# EAGLE design NRF - Nano (EAGLE 6.5.0)
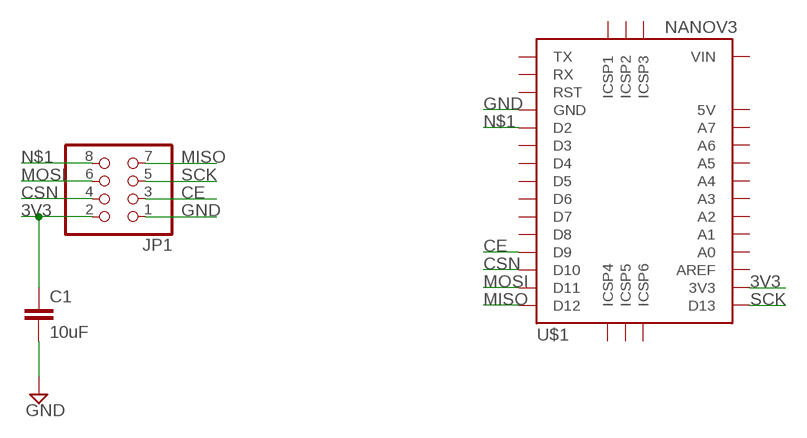
[diagram p0: schematic, sheet 1]

## Parts
C1  10uF  CAPPTH2  [CAP-PTH-SMALL2]
JP1  PINHD-2X4  [2X04]
U$1  NANOV3  [NANOV3]

## Nets
3V3: C1.1 JP1.2 U$1.3V3
CE: JP1.3 U$1.D9
CSN: JP1.4 U$1.D10
GND: C1.2 JP1.1 U$1.GND1(GND) U$1.GND2(GND)
MISO: JP1.7 U$1.D12
MOSI: JP1.6 U$1.D11
N$1: JP1.8 U$1.D2
SCK: JP1.5 U$1.D13
Unconnected: U$1.5V U$1.A0 U$1.A1 U$1.A2 U$1.A3 U$1.A4 U$1.A5 U$1.A6 U$1.A7 U$1.AREF U$1.D3 U$1.D4 U$1.D5 U$1.D6 U$1.D7 U$1.D8 U$1.P$31(ICSP4) U$1.P$32(ICSP5) U$1.P$33(ICSP6) U$1.P$34(ICSP1) U$1.P$35(ICSP2) U$1.P$36(ICSP3) U$1.RST1(RST) U$1.RST2(RST) U$1.RX U$1.TX

## Power pins joined to a net without a drawn wire
VIN: U$1.VIN

## Library data of the parts
C1 = SparkFun-Capacitors:CAP: Capacitor Standard 0603 ceramic capacitor, and 0.1" leaded capacitor.
JP1 = pinhead:PINHD-2X4: PIN HEADER
U$1 = Franc:NANOV3: Arduino Nano Version 3 (v3)

## Board
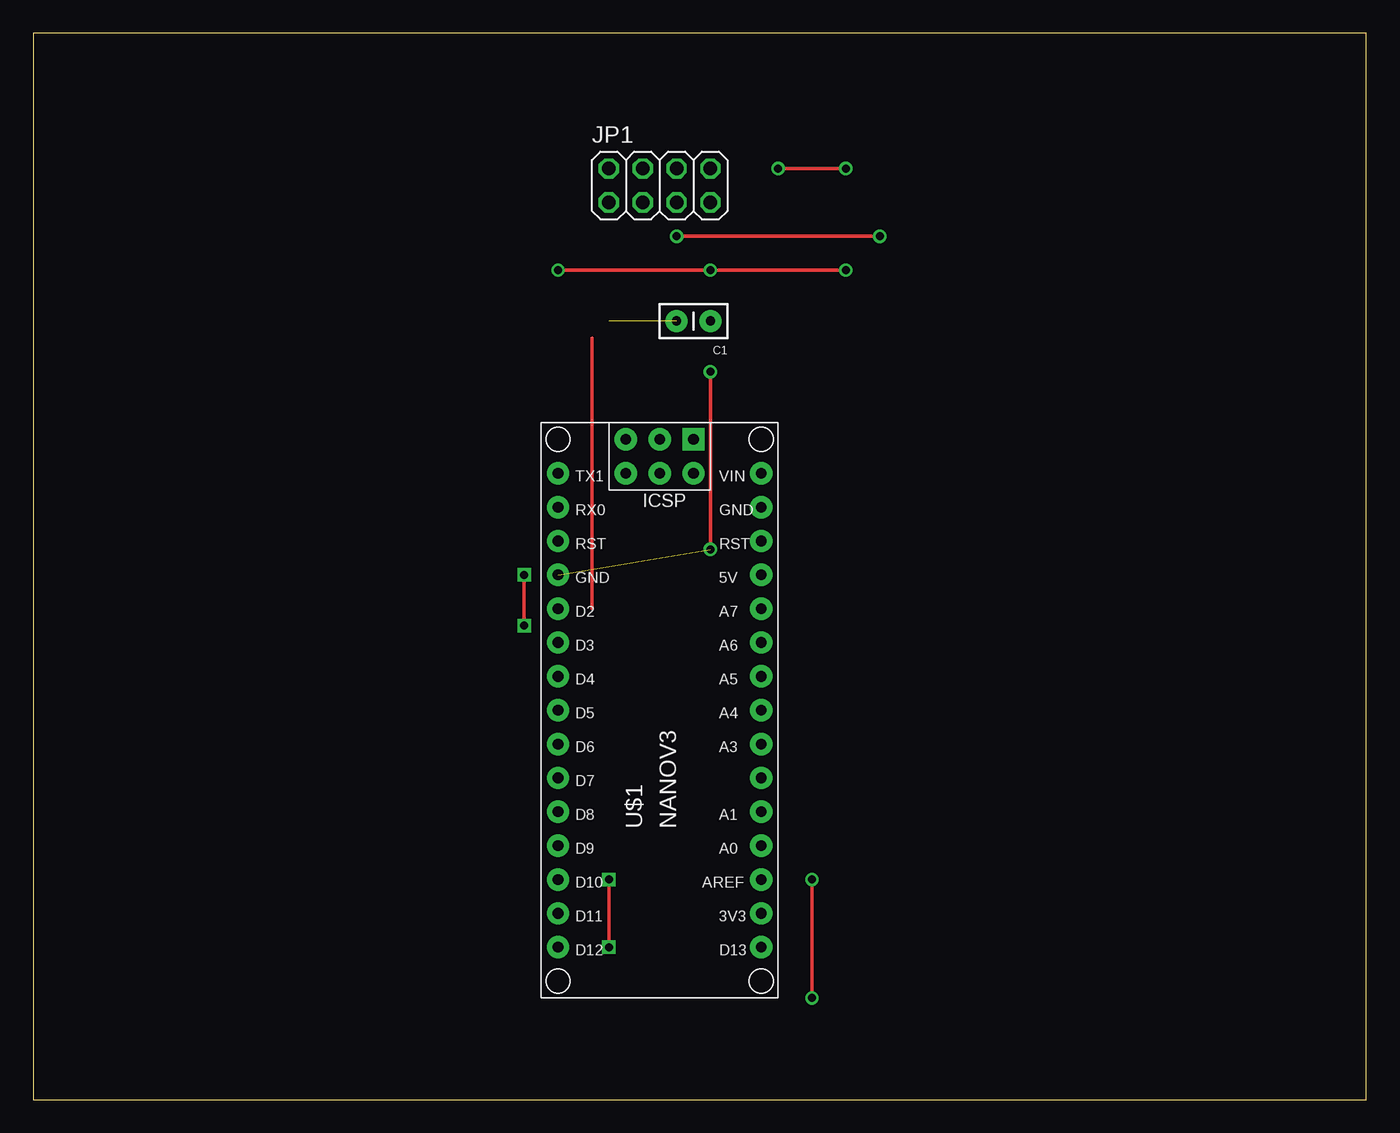
[diagram p1: board, top side]
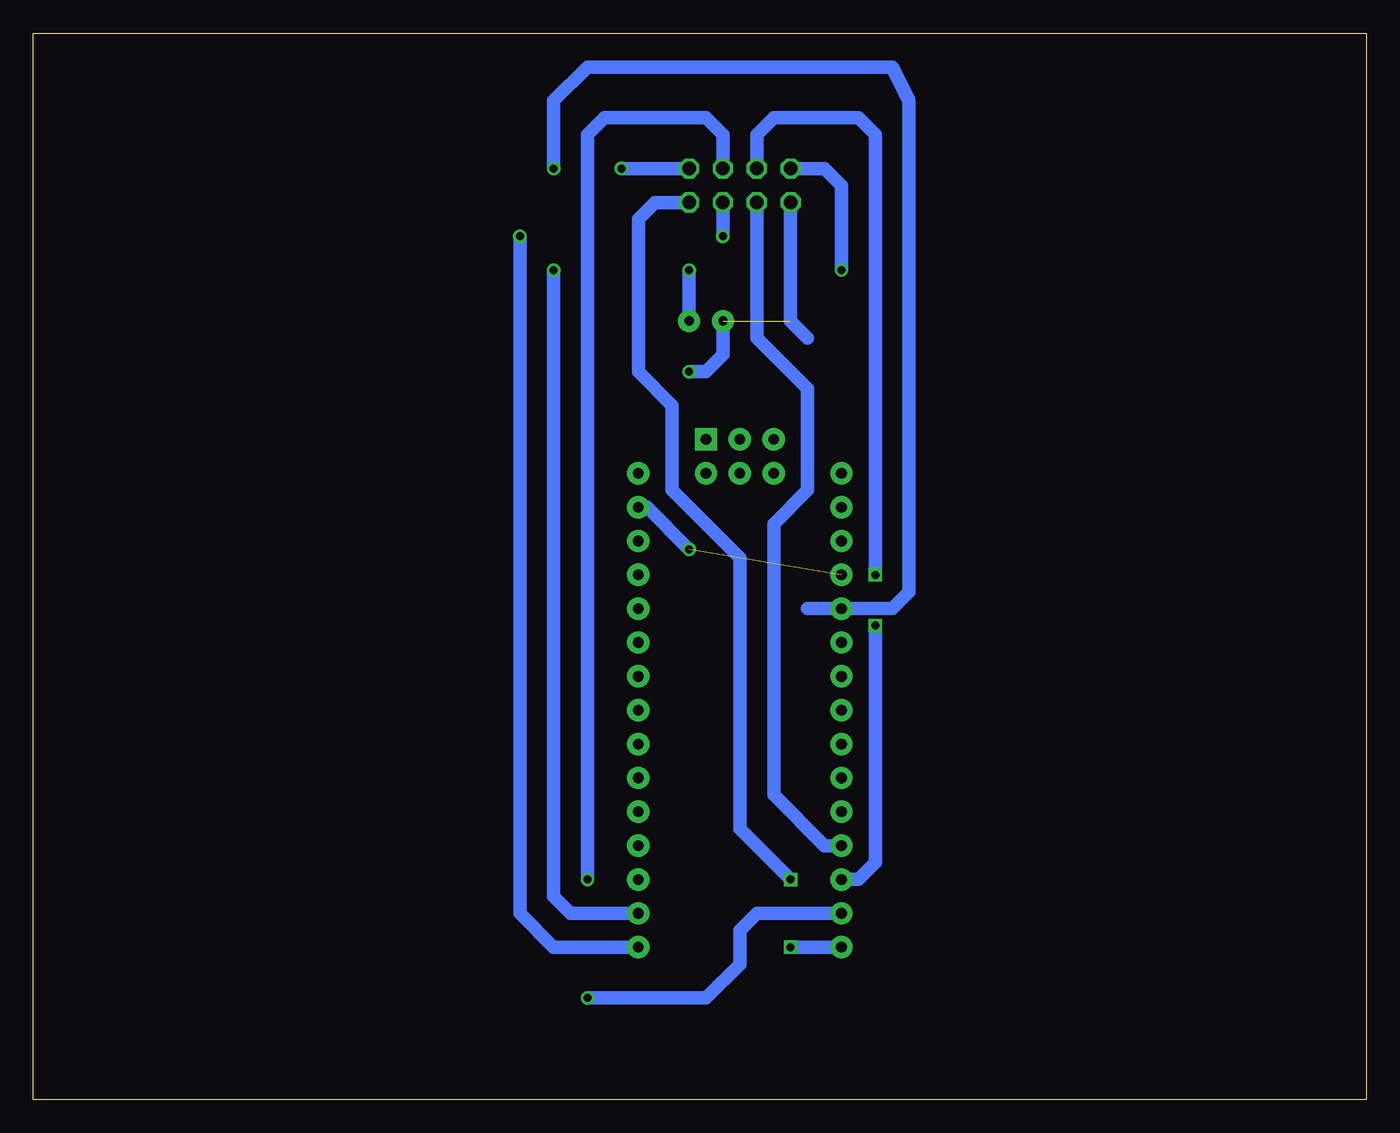
[diagram p2: board, bottom side, seen from below]

Size 100 x 80 mm. Coordinates in mm from the lower left corner, seen from the top.
Outline: 0,0 100,0 100,80 0,80 0,0
Copper layers (1*16): Top 0.035mm / dielectric 1.5mm / Bottom 0.035mm
Design rules "default": minimum track width 10mil, minimum drill 24mil, track to track 8mil, track to pad 8mil, pad to pad 8mil, via to via 8mil, smd to smd 8mil, copper to edge 40mil, drill to drill 8mil, minimum pad ring 10mil, minimum via ring 8mil, stop-mask expansion 4mil, vias tented up to drill 0mil, thermal gap 10mil

### Footprints (pad centres in the part's own frame; a part is rotated, then mirrored left to right if it is on the bottom)
CAP-PTH-SMALL2 = drill 0.7 pad 1.651: 1 0,0; 2 2.54,0
2X04 = drill 1.016 octagon: 1 -3.81,-1.27; 2 -3.81,1.27; 3 -1.27,-1.27; 4 -1.27,1.27; 5 1.27,-1.27; 6 1.27,1.27; 7 3.81,-1.27; 8 3.81,1.27
NANOV3 = drill 0.8 pad 1.676: 3V3 7.62,-15.24; 5V 7.62,10.16; A0 7.62,-10.16; A1 7.62,-7.62; A2 7.62,-5.08; A3 7.62,-2.54; A4 7.62,0; A5 7.62,2.54; A6 7.62,5.08; A7 7.62,7.62; AREF 7.62,-12.7; D2 -7.62,7.62; D3 -7.62,5.08; D4 -7.62,2.54; D5 -7.62,0; D6 -7.62,-2.54; D7 -7.62,-5.08; D8 -7.62,-7.62; D9 -7.62,-10.16; D10 -7.62,-12.7; D11 -7.62,-15.24; D12 -7.62,-17.78; D13 7.62,-17.78; GND1 -7.62,10.16; GND2 7.62,15.24; P$31 -2.54,20.32; P$32 0,20.32; P$34 2.54,17.78; P$35 0,17.78; P$36 -2.54,17.78; RST1 -7.62,12.7; RST2 7.62,12.7; RX -7.62,15.24; TX -7.62,17.78; VIN 7.62,17.78 | drill 0.8 pad 1.676 square: P$33 2.54,20.32

### Placement (x,y rotation side)
C1  50.8,58.42 180 top
JP1  46.99,68.58 0 top
U$1  46.99,29.21 0 top

### Tracks (layer width: path | path; a pad name or v marks a point on that pad's centre or on a via)
3V3  (via drill 0.6)
  Top 0.254: v39.37,62.23 v50.8,62.23 v60.96,62.23
  Bottom 1.016: JP1.2 40.64,69.85 39.37,68.58 v39.37,62.23 | C1.1 v50.8,62.23 | U$1.3V3 59.69,13.97 60.96,15.24 v60.96,62.23
CE
  Bottom 1.016: U$1.D9 40.64,19.05 44.45,22.86 44.45,43.18 41.91,45.72 41.91,53.34 45.72,57.15 JP1.3
CSN  (via drill 0.6)
  Top 0.254: v36.83,39.37 v36.83,35.56
  Bottom 1.016: JP1.4 45.72,72.39 44.45,73.66 38.1,73.66 36.83,72.39 v36.83,39.37 | U$1.D10 38.1,16.51 36.83,17.78 v36.83,35.56
GND  (via drill 0.6)  (2 unrouted)
  Top 0.254: v50.8,54.61 v50.8,41.27
  Bottom 1.016: JP1.1 43.18,58.42 41.91,57.15 | C1.2 48.26,55.88 49.53,54.61 v50.8,54.61 | U$1.GND2 53.98,44.45 v50.8,41.27
MISO  (via drill 0.6)
  Top 0.254: v43.18,11.43 v43.18,16.51
  Bottom 1.016: U$1.D12 v43.18,11.43 | v43.18,16.51 46.99,20.32 46.99,40.64 52.07,45.72 52.07,52.07 54.61,54.61 54.61,66.04 53.34,67.31 JP1.7
MOSI  (via drill 0.6)
  Top 0.254: v58.42,7.62 v58.42,16.51
  Bottom 1.016: JP1.6 48.26,72.39 49.53,73.66 57.15,73.66 58.42,72.39 v58.42,16.51 | U$1.D11 45.72,13.97 46.99,12.7 46.99,10.16 49.53,7.62 v58.42,7.62
N$1  (via drill 0.6)
  Top 0.254: v55.88,69.85 v60.96,69.85
  Bottom 1.016: v60.96,69.85 60.96,74.93 58.42,77.47 35.56,77.47 34.29,74.93 34.29,38.1 35.56,36.83 U$1.D2 41.91,36.83 | JP1.8 v55.88,69.85
N$2
  Top 0.254: 41.91,36.83 41.91,57.15
SCK  (via drill 0.6)
  Top 0.254: v48.26,64.77 v63.5,64.77
  Bottom 1.016: U$1.D13 60.96,11.43 63.5,13.97 v63.5,64.77 | JP1.5 v48.26,64.77